# EAGLE design accelerometer (EAGLE 6.2)
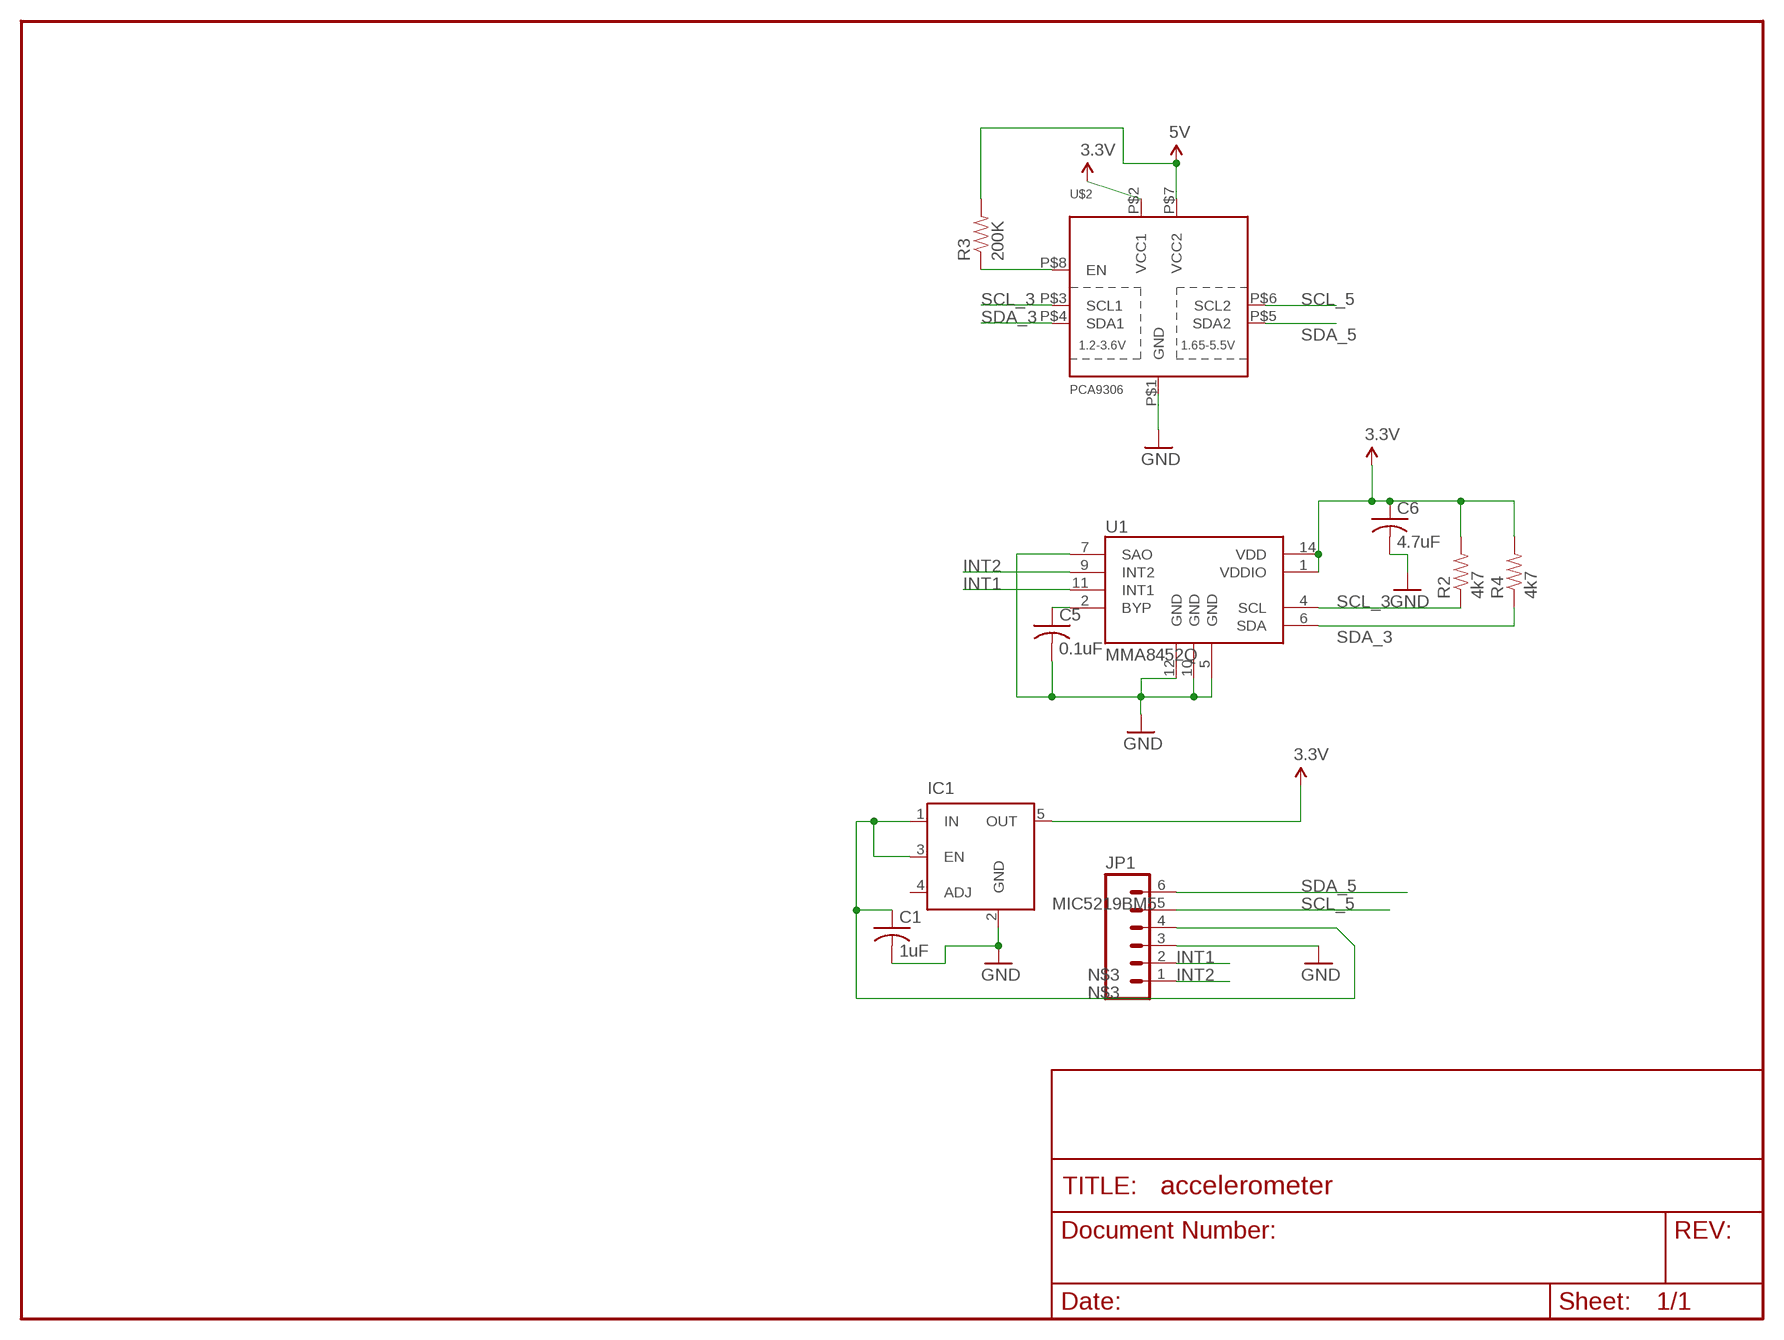
[diagram p0: schematic, sheet 1]

## Parts
C1  1uF  C-USC0603K  [C0603K]
C5  0.1uF  C-USC0603K  [C0603K]
C6  4.7uF  C-USC0603K  [C0603K]
IC1  MIC5219BM5  [SOT23-5]
JP1  M06LOCK  [1X06_LOCK]
R2  4k7  RESISTOR0603-RES  [0603-RES]
R3  200K  RESISTOR0603-RES  [0603-RES]
R4  4k7  RESISTOR0603-RES  [0603-RES]
U1  MMA8452Q  [QFN-16(5X3)]
U$2  PCA9306  [VSSOP-8]

## Nets
3.3V: C6.1 IC1.5(OUT) R2.2 R4.2 U1.1(VDDIO) U1.14(VDD) U$2.P$2(VCC1)
5V: R3.2 U$2.P$7(VCC2)
GND: C1.2 C5.2 C6.2 IC1.2(GND) JP1.3 U1.5(GND) U1.7(SAO) U1.10(GND) U1.12(GND) U$2.P$1(GND)
INT1: JP1.2 U1.11(INT1)
INT2: JP1.1 U1.9(INT2)
N$1: C5.1 U1.2(BYP)
N$3: C1.1 IC1.1(IN) IC1.3(EN) JP1.4
N$4: R3.1 U$2.P$8(EN)
SCL_3: R2.1 U1.4(SCL) U$2.P$3(SCL1)
SCL_5: JP1.5 U$2.P$6(SCL2)
SDA_3: R4.1 U1.6(SDA) U$2.P$4(SDA1)
SDA_5: JP1.6 U$2.P$5(SDA2)
Unconnected: IC1.4(ADJ)

## Library data of the parts
C1 C5 C6 = resistor:C-US: CAPACITOR, American symbol
IC1 = v-reg-micrel:MIC5219BM5: VOLTAGE REGULATOR; MF: ALTERA CORPORATION; MPN: MIC5219BM5 TR; OC_FARNELL: 1100656; OC_NEWARK: 09J8939
JP1 = SparkFun:M06: Header 6 Standard 6-pin 0.1" header. Use with straight break away headers (SKU : PRT-00116), right angle break away headers (PRT-00553), swiss pins (PRT-00743), machine pins (PRT-00117), and female headers (PRT-00115). Molex polarized connector foot print use with SKU : PRT-08094 with associated crimp pins and housings. NOTES ON THE VARIANTS LOCK and LOCK_LONGPADS... This footprint was designed to help hold the alignment of a through-hole component (i.e. 6-pin header) while soldering it into place. You may notice that each hole has been shifted either up or down by 0.005 of an inch from it's more standard position (which is a perfectly straight line). This slight alteration caused the pins (the squares in the middle) to touch the edges of the holes. Because they are alternating, it causes a "brace" to hold the component in place. 0.005 has proven to be the perfect amount of "off-center" position when using our standard breakaway headers. Although looks a little odd when you look at the bare footprint, once you have a header in there, the alteration is very hard to notice. Also, if you push a header all the way into place, it is covered up entirely on the bottom side. This idea of altering the position of holes to aid alignment will be further integrated into the Sparkfun Library for other footprints. It can help hold any component with 3 or more connection pins.
R2-R4 = SparkFun:RESISTOR: Resistor Basic schematic elements and footprints for 0603, 1206, and PTH resistors.
U1 = hackerscouts:MMA8452Q
U$2 = hackerscouts:PCA9306

## Board
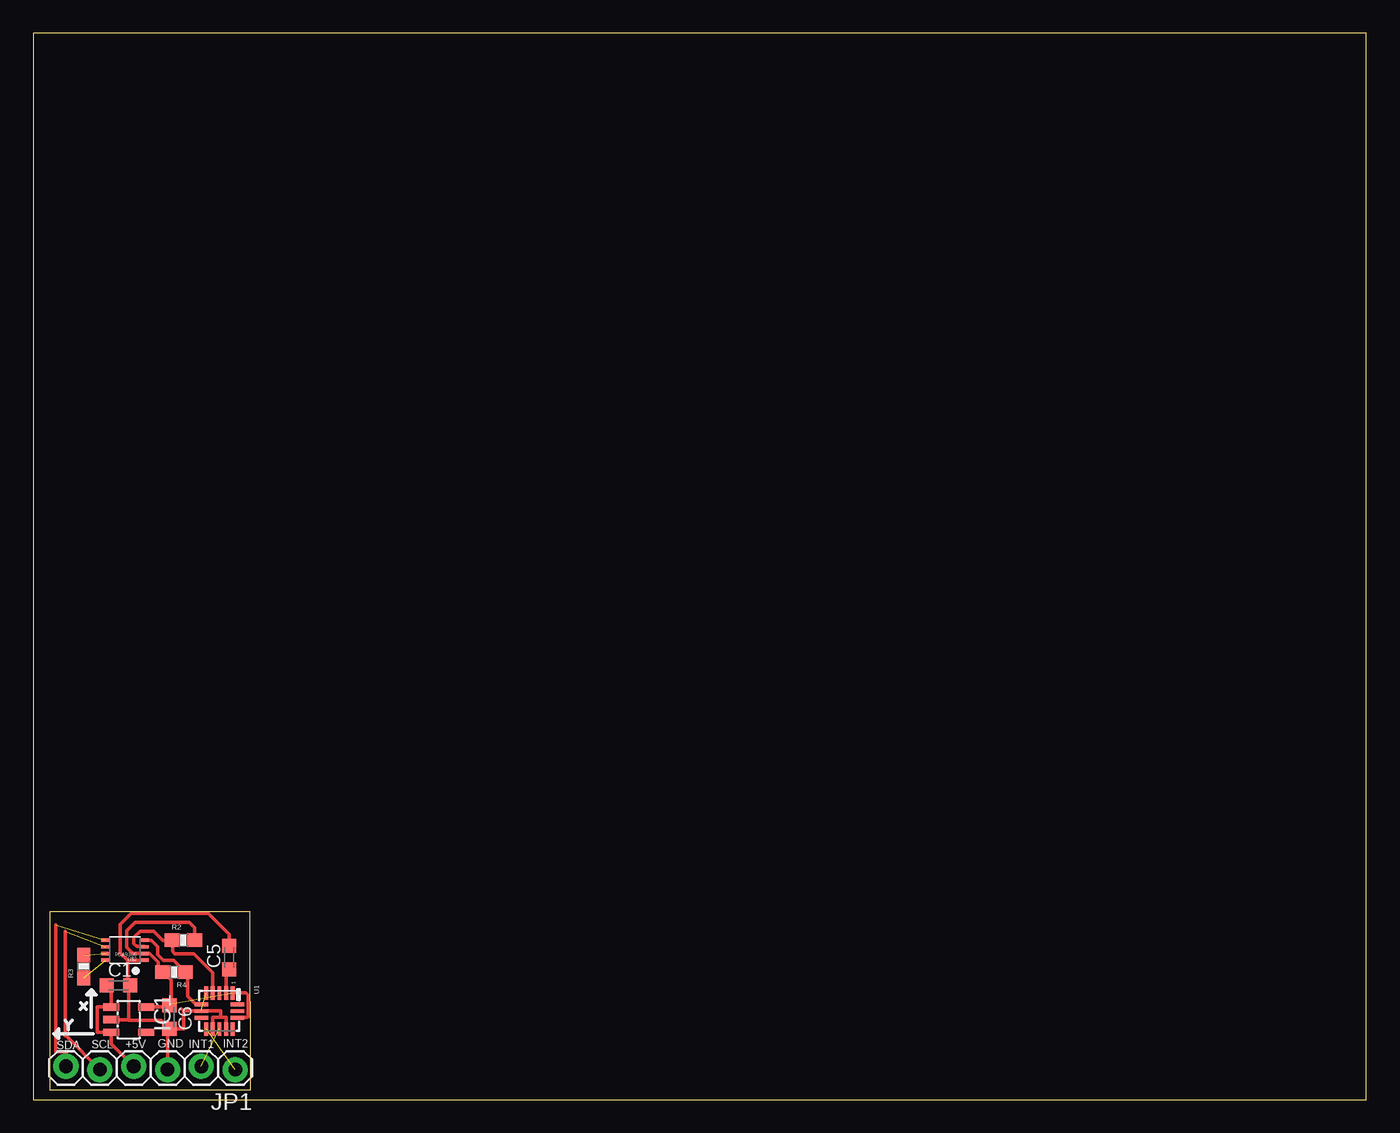
[diagram p1: board, top side]
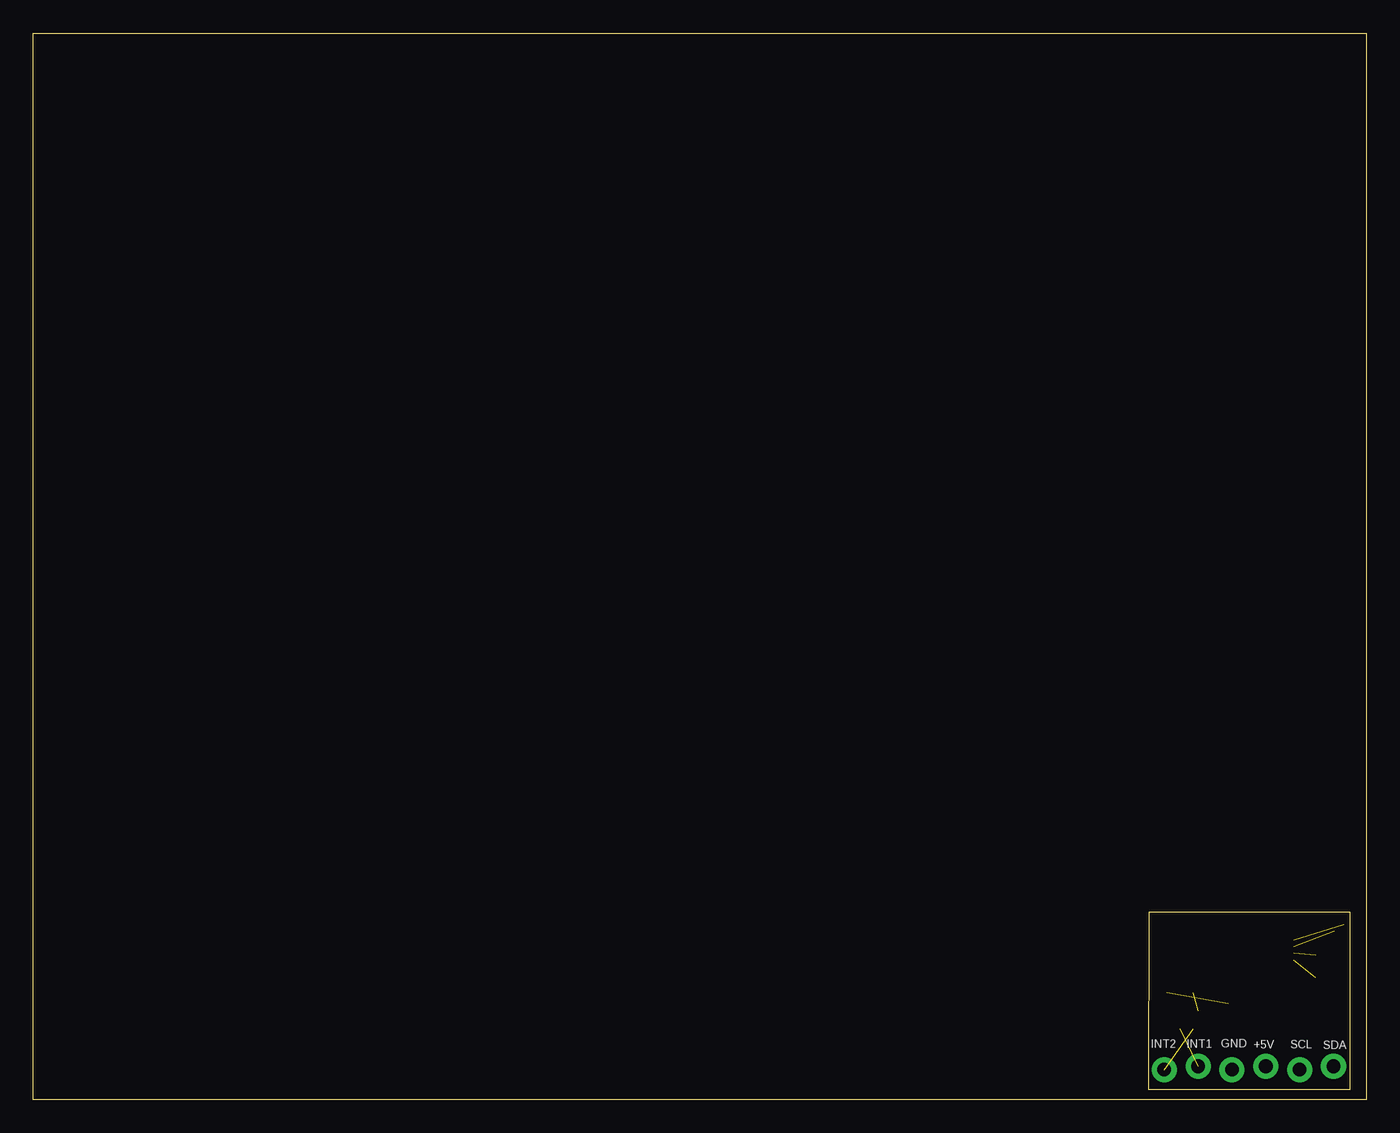
[diagram p2: board, bottom side, seen from below]

Size 100 x 80 mm. Coordinates in mm from the lower left corner, seen from the top.
Outline: 0,0 100,0 100,80 0,80 0,0
Outline: 1.24,0.73 16.29,0.73 16.28,14.1 1.23,14.1 1.24,0.73
Copper layers (1*16): Top 0.035mm / dielectric 1.5mm / Bottom 0.035mm
Design rules: minimum track width 10mil, minimum drill 24mil, track to track 6mil, track to pad 6mil, pad to pad 6mil, via to via 6mil, smd to smd 6mil, copper to edge 40mil, drill to drill 8mil, minimum pad ring 10mil, minimum via ring 8mil, stop-mask expansion 4mil, vias tented up to drill 0mil, thermal gap 10mil

### Footprints (pad centres in the part's own frame; a part is rotated, then mirrored left to right if it is on the bottom)
C0603K = smd 1.05 x 1.08: 1 -0.875,0; 2 0.875,0
SOT23-5 = smd 0.55 x 1.2: 1 -0.95,-1.3; 2 0,-1.3; 3 0.95,-1.3; 4 0.95,1.3; 5 -0.95,1.3
1X06_LOCK = drill 1.016 pad 1.88: 1 0,0; 2 2.54,-0.254; 3 5.08,0; 4 7.62,-0.254; 5 10.16,0; 6 12.7,-0.254
0603-RES = smd 1.1 x 1: 1 -0.85,0; 2 0.85,0
QFN-16(5X3) = smd 1 x 0.295: 1 -1.35,1; 2 -1.35,0.5; 3 -1.35,0; 4 -1.35,-0.5; 5 -1.35,-1; 9 1.35,-1; 10 1.35,-0.5; 11 1.35,0; 12 1.35,0.5; 13 1.35,1 | smd 0.295 x 1: 6 -0.5,-1.35; 7 0,-1.35; 8 0.5,-1.35; 14 0.5,1.35; 15 0,1.35; 16 -0.5,1.35
VSSOP-8 = smd 0.25 x 0.65: P$1 -0.75,-1.45; P$2 -0.25,-1.45; P$3 0.25,-1.45; P$4 0.75,-1.45; P$5 0.75,1.45; P$6 0.25,1.45; P$7 -0.25,1.45; P$8 -0.75,1.45

### Placement (x,y rotation side)
C1  6.39,8.57 0 top
C5  14.69,10.66 90 top
C6  10.22,6.19 270 top
IC1  7.16,5.99 270 top
JP1  15.15,2.24 180 top
R2  11.25,11.96 0 top
R3  3.78,9.98 90 top
R4  10.56,9.56 180 top
U1  13.96,6.64 270 top
U$2  6.88,11.21 90 top

### Tracks (layer width: path | path; a pad name or v marks a point on that pad's centre or on a via)
3.3V  (1 unrouted)
  Top 0.254: U1.14 15.31,6.16 16.04,6.16 16.1,6.22 16.1,7.81 15.92,7.99 U1.1 | IC1.5 10.22,6.94 C6.1 10.33,7.17 10.33,8.94 R4.2 9.37,9.9 9.37,10.29 8.7,10.96 U$2.P$2 7.46,10.97 7.02,11.41 7.02,12.65 7.66,13.29 11.68,13.29 12.1,12.87 R2.2
5V  (1 unrouted)
GND  (1 unrouted)
  Top 0.254: U1.12 14.45,6.18 14.07,6.18 | 14.07,6.18 13.46,6.18 U1.10 | 14.07,6.18 14.07,6.64 U1.7 11.28,6.64 | C6.2 11.28,5.32 11.28,6.64 | C6.2 10.07,5.32 JP1.3 | 7.17,5.94 7.17,8.47 C1.2 7.08,8.76 7.08,10.43 | 7.17,5.94 7.12,5.99 IC1.2 | C6.2 9.6,5.94 7.17,5.94 | 11.1,6.82 11.28,6.64 | C5.2 14.69,12.39 13.1,13.98 7.35,13.98 6.53,13.16 6.53,10.98 7.08,10.43 | 7.08,10.43 8.3,10.43 U$2.P$1
INT1  (1 unrouted)
INT2  (1 unrouted)
N$1
  Top 0.254: U1.2 14.46,9.55 C5.1
N$3
  Top 0.254: C1.1 5.86,7.96 IC1.1 4.8,6.94 4.8,5.04 IC1.3 5.86,4.16 JP1.4
N$4  (1 unrouted)
SCL_3
  Top 0.254: U$2.P$3 8.3,11.49 7.75,11.49 7.54,11.7 7.54,12.17 8,12.63 9.03,12.63 9.7,11.96 R2.1 10.44,11.92 10.44,11.12 10.62,10.94 12.03,10.94 13.46,9.51 U1.4
SCL_5  (1 unrouted)
  Top 0.254: 2.41,12.61 2.41,4.77 2.46,4.77 JP1.5
SDA_3
  Top 0.254: U1.6 12.18,7.14 11.58,7.74 11.58,9.39 R4.1 10.52,10.45 9.76,10.45 9.34,10.87 9.34,11.45 8.83,11.96 U$2.P$4
SDA_5  (1 unrouted)
  Top 0.254: 1.69,13.11 1.69,3.57 2.45,3.57 JP1.6

### Text on the board
tPlace: SDA | SCL | +5V | GND | INT1 | INT2
bPlace: SDA | SCL | +5V | GND | INT1 | INT2